# Altium schematic sheet 10.RGB_LED.SchDoc
size A4; SheetNumber: 11; SheetTotal: 13
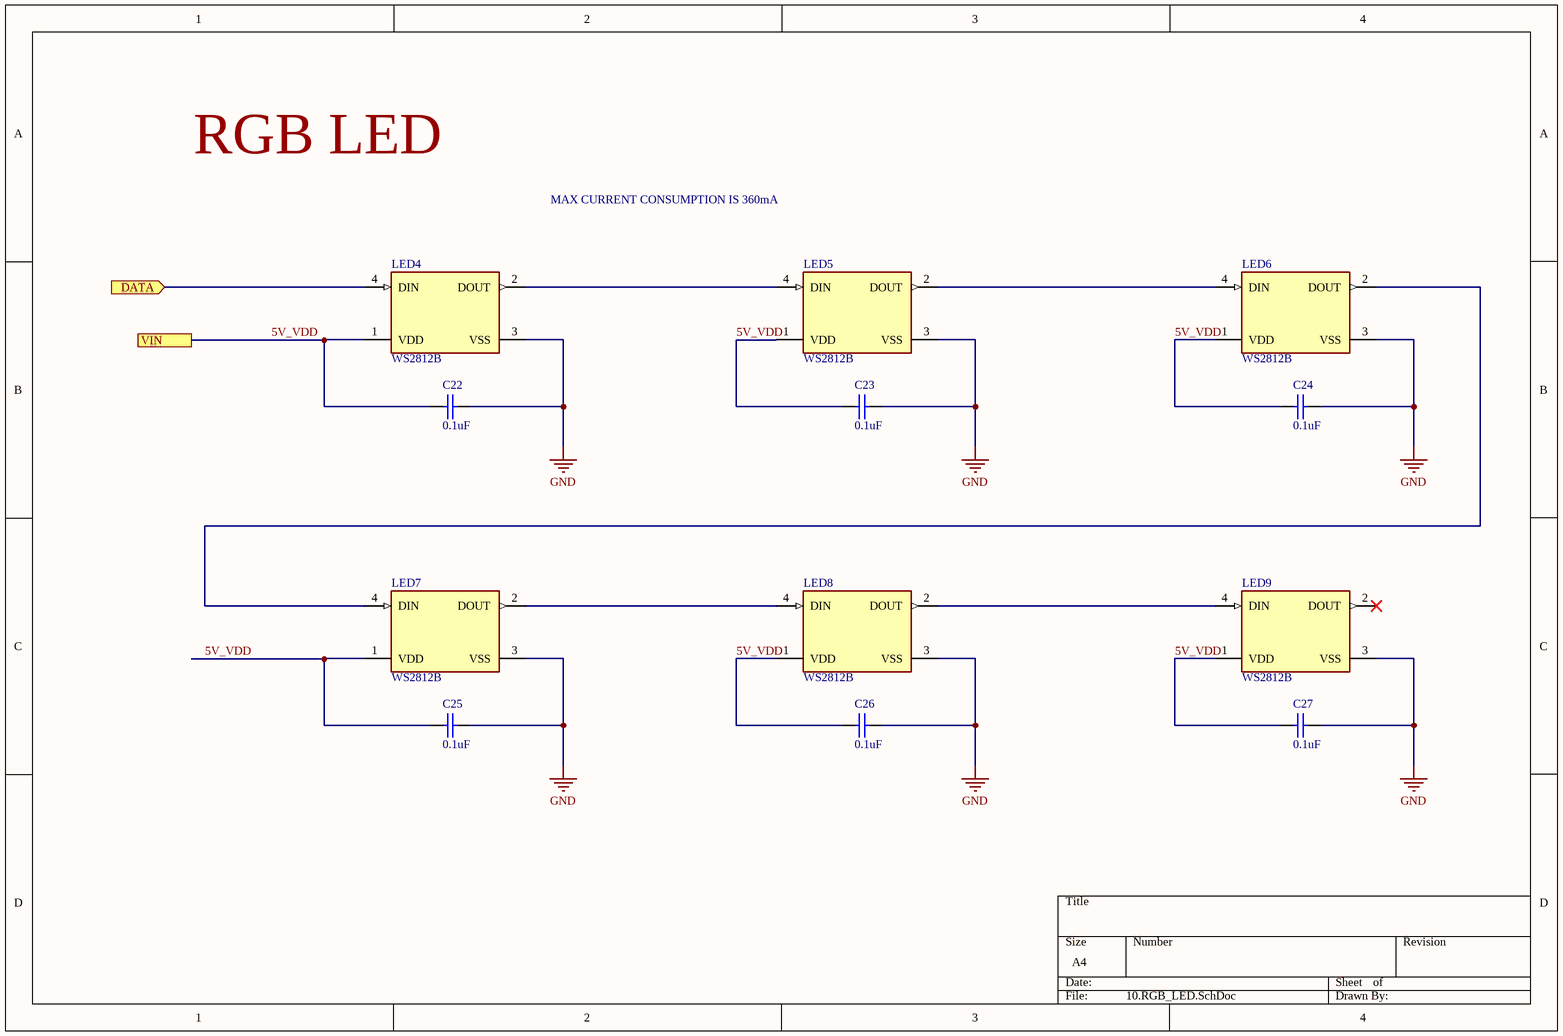
[diagram p0: 10.RGB_LED.SchDoc]

## Parts
C22  0.1uF  [C_0603]
C23  0.1uF  [C_0603]
C24  0.1uF  [C_0603]
C25  0.1uF  [C_0603]
C26  0.1uF  [C_0603]
C27  0.1uF  [C_0603]
LED4  WS2812B  [WS2812B]
LED5  WS2812B  [WS2812B]
LED6  WS2812B  [WS2812B]
LED7  WS2812B  [WS2812B]
LED8  WS2812B  [WS2812B]
LED9  WS2812B  [WS2812B]

## Ports
DATA (in), VIN

## Nets
GND: C22.1 C23.1 C24.1 C25.1 C26.1 C27.1 LED4.3(VSS) LED5.3(VSS) LED6.3(VSS) LED7.3(VSS) LED8.3(VSS) LED9.3(VSS)
5V_VDD: C22.2 C23.2 C24.2 C25.2 C26.2 C27.2 LED4.1(VDD) LED5.1(VDD) LED6.1(VDD) LED7.1(VDD) LED8.1(VDD) LED9.1(VDD) ; port VIN
DATA: LED4.4(DIN) ; port DATA
NetLED4_2: LED4.2(DOUT) LED5.4(DIN)
NetLED5_2: LED5.2(DOUT) LED6.4(DIN)
NetLED6_2: LED6.2(DOUT) LED7.4(DIN)
NetLED7_2: LED7.2(DOUT) LED8.4(DIN)
NetLED8_2: LED8.2(DOUT) LED9.4(DIN)

Not connected (* = marked no-connect by the designer): LED9 2(DOUT)*

## Notes on the sheet
- RGB LED
- MAX CURRENT CONSUMPTION IS 360mA

## Library data of the parts
C22-C27 = C_0603: D: *; MFR: *; P: *; PN: *; URL: *